# EAGLE design FTDI_PROG3_eagle7x (EAGLE 7.7.0)
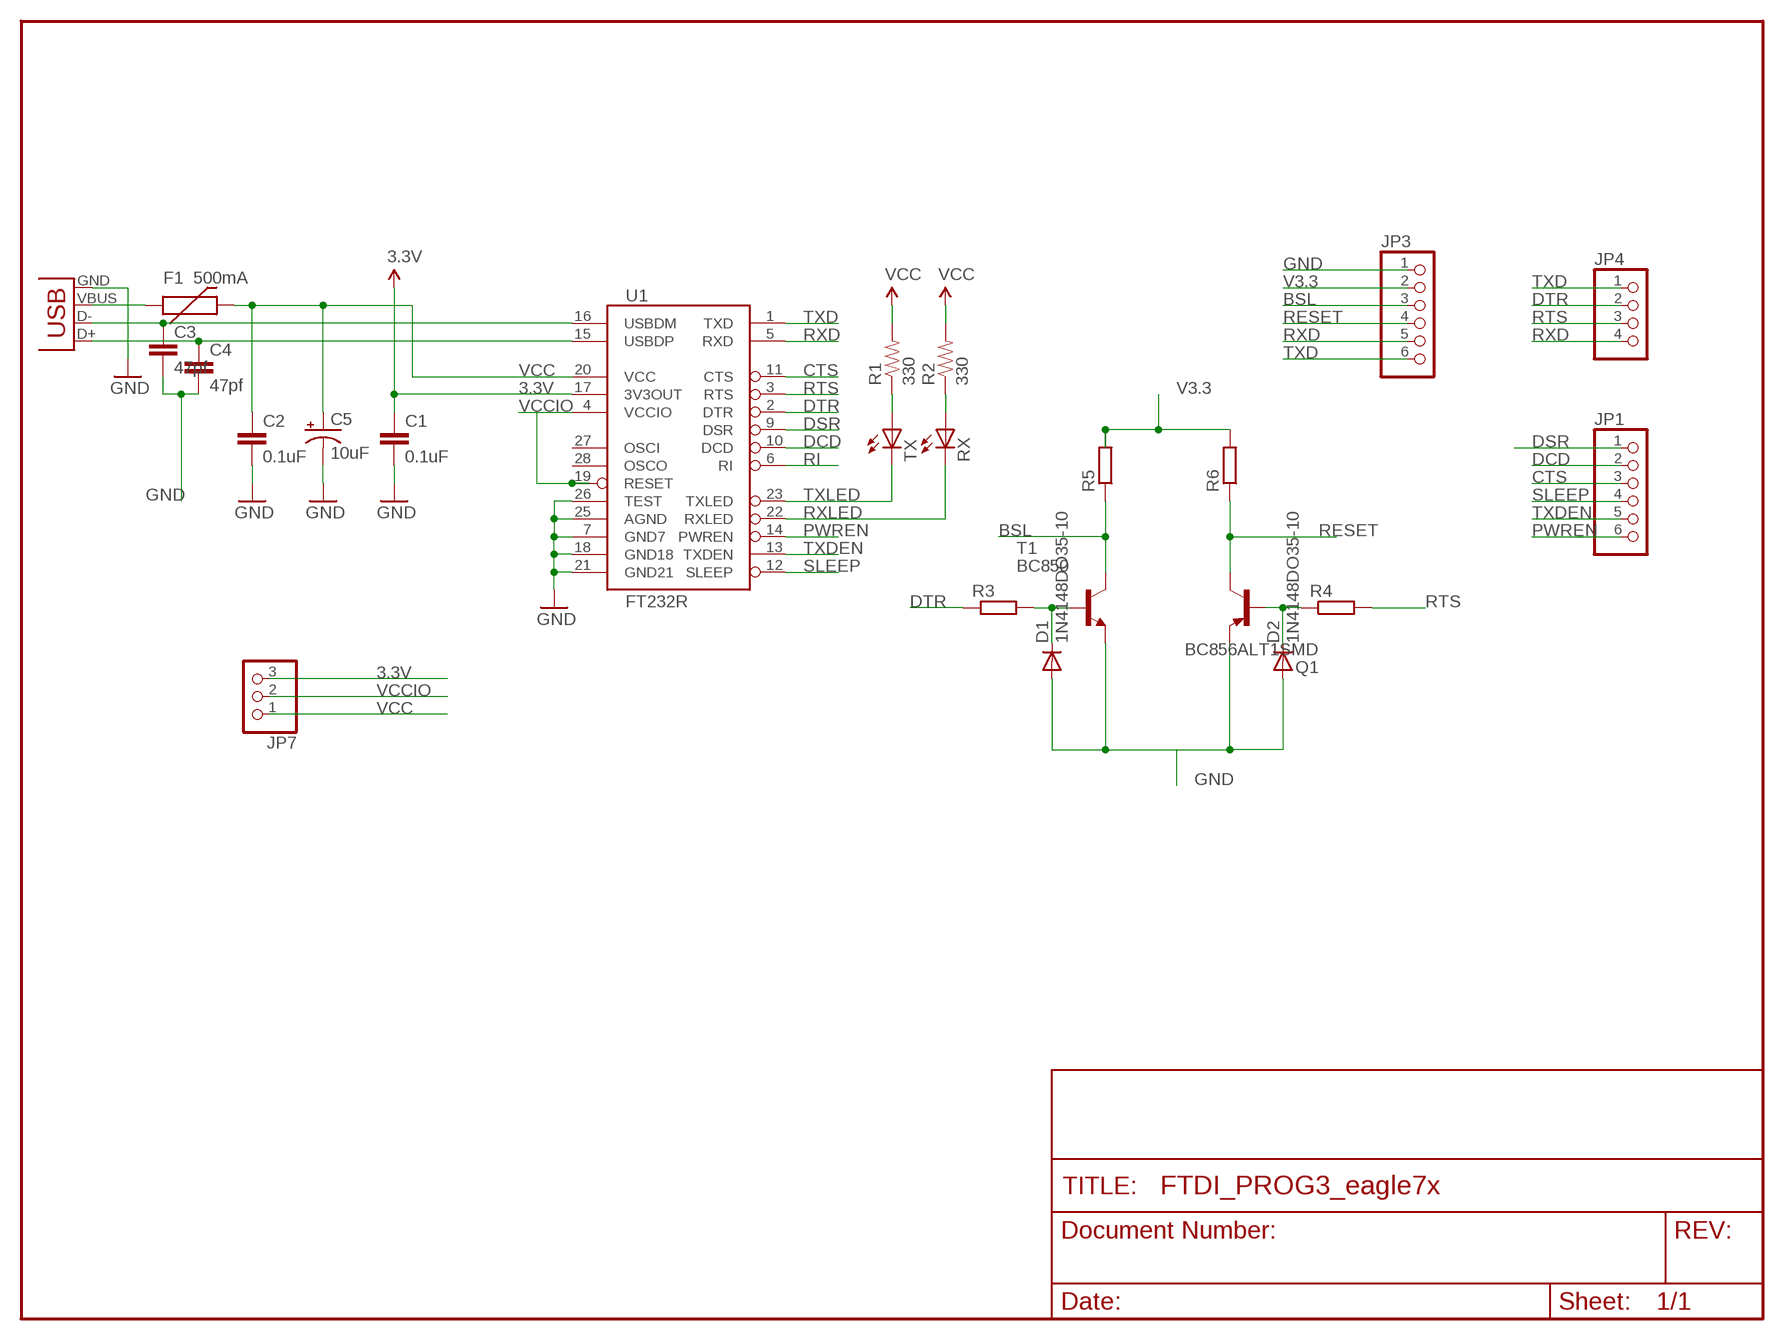
[diagram p0: schematic, sheet 1]

## Parts
C1  0.1uF  CAP1206  [1206]
C2  0.1uF  CAP1206  [1206]
C3  47pf  C-EU025-024X044  [C025-024X044]
C4  47pf  C-EU025-025X050  [C025-025X050]
C5  10uF  CAP_POLPTH1  [CPOL-RADIAL-100UF-25V]
D1  1N4148DO35-10  [DO35-10]
D2  1N4148DO35-10  [DO35-10]
F1  500mA  PTCSMD  [PTC-1206]
JP1  PINHD-1X6  [1X06]
JP3  PINHD-1X6  [1X06]
JP4  PINHD-1X4  [1X04]
JP7  PINHD-1X3  [1X03]
Q1  BC856ALT1SMD  [SOT23-BEC]
R1  330  RESISTOR1206  [1206]
R2  330  RESISTOR1206  [1206]
R3  R-EU_0207/10  [0207/10]
R4  R-EU_0207/10  [0207/10]
R5  R-EU_0207/10  [0207/10]
R6  R-EU_0207/10  [0207/10]
RX  LED1206  [LED-1206]
T1  BC850  [SOT23]
TX  LED1206  [LED-1206]
U1  FT232R  FT232RLSSOP  [SSOP28DB]
X2  USBPTH  [USB-B-PTH]

## Nets
3.3V [power]: C1.1 JP7.3 U1.17(3V3OUT)
BSL: JP3.3 R5.1 T1.3(C)
CTS: JP1.3 U1.11(CTS)
DCD: JP1.2 U1.10(DCD)
DSR: JP1.1 U1.9(DSR)
DTR: JP4.2 R3.1 U1.2(DTR)
GND [power]: C1.2 C2.2 C3.2 C4.2 C5.2(-) D1.A D2.A JP3.1 Q1.E T1.2(E) U1.7(GND7) U1.18(GND18) U1.21(GND21) U1.25(AGND) U1.26(TEST) X2.GND
N$1: R1.1 TX.A
N$2: R2.1 RX.A
N$3: F1.1 X2.VBUS
N$4: D1.C R3.2 T1.1(B)
N$5: D2.C Q1.B R4.1
PWREN: JP1.6 U1.14(PWREN)
RESET: JP3.4 Q1.C R6.1
RI: U1.6(RI)
RTS: JP4.3 R4.2 U1.3(RTS)
RXD: JP3.5 JP4.4 U1.5(RXD)
RXLED: RX.C U1.22(RXLED)
SLEEP: JP1.4 U1.12(SLEEP)
TXD: JP3.6 JP4.1 U1.1(TXD)
TXDEN: JP1.5 U1.13(TXDEN)
TXLED: TX.C U1.23(TXLED)
USB_D+: C4.1 U1.15(USBDP) X2.D+
USB_D-: C3.1 U1.16(USBDM) X2.D-
V3.3: JP3.2 R5.2 R6.2
VCC [power]: C2.1 C5.1(+) F1.2 JP7.1 R1.2 R2.2 U1.20(VCC)
VCCIO: JP7.2 U1.4(VCCIO) U1.19(RESET)
Unconnected: U1.27(OSCI) U1.28(OSCO)

## Library data of the parts
C1 C2 = SparkFun:CAP: Capacitor Standard 0603 ceramic capacitor, and 0.1" leaded capacitor.
C3 C4 = rcl:C-EU: CAPACITOR, European symbol
C5 = SparkFun:CAP_POL: Capacitor Polarized These are standard SMD and PTH capacitors. Normally 10uF, 47uF, and 100uF in electrolytic and tantalum varieties. Always verify the external diameter of the through hole cap, it varies with capacity, voltage, and manufacturer. The EIA devices should be standard.
D1 D2 = diode:1N4148: DIODE high speed (Philips)
F1 = SparkFun:PTC: Resettable Fuse PTC Resettable Fuse. Spark Fun Electronics SKU : COM-08357
JP1 JP3 = pinhead:PINHD-1X6: PIN HEADER
JP4 = pinhead:PINHD-1X4: PIN HEADER
JP7 = pinhead:PINHD-1X3: PIN HEADER
Q1 = transistor-pnp:BC856*: PNP Transistror
R1 R2 = SparkFun:RESISTOR: Resistor Basic schematic elements and footprints for 0603, 1206, and PTH 1/10th watt (small) resistors.
R3-R6 = resistor:R-EU_: RESISTOR, European symbol
RX TX = SparkFun:LED: LEDs Standard schematic elements and footprints for 5mm, 3mm, 1206, and 0603 sized LEDs. 5mm - Spark Fun Electronics SKU : COM-00529 (and others)
T1 = transistor:BC850: NPN TRANSISTOR
U1 = SparkFun:FT232RL: USB UART FT232RL 4th Generation USB UART (USB <-> Serial) Controller. Spark Fun Electronics SKU : COM-00650
X2 = SparkFun:USB: USB Connectors USB-B-PTH is fully proven SKU : PRT-00139 USB-miniB is fully proven SKU : PRT-00587 USB-A-PCB is untested. USB-A-H is throughly reviewed, but untested. Spark Fun Electronics SKU : PRT-00437 USB-B-SMT is throughly reviewed, but untested. Needs silkscreen touching up. USB-A-S has not been used/tested USB-MB-H has not been used/tested

## Net classes
0 default: width 0.203 mm
1 power: width 0.254 mm

## Board
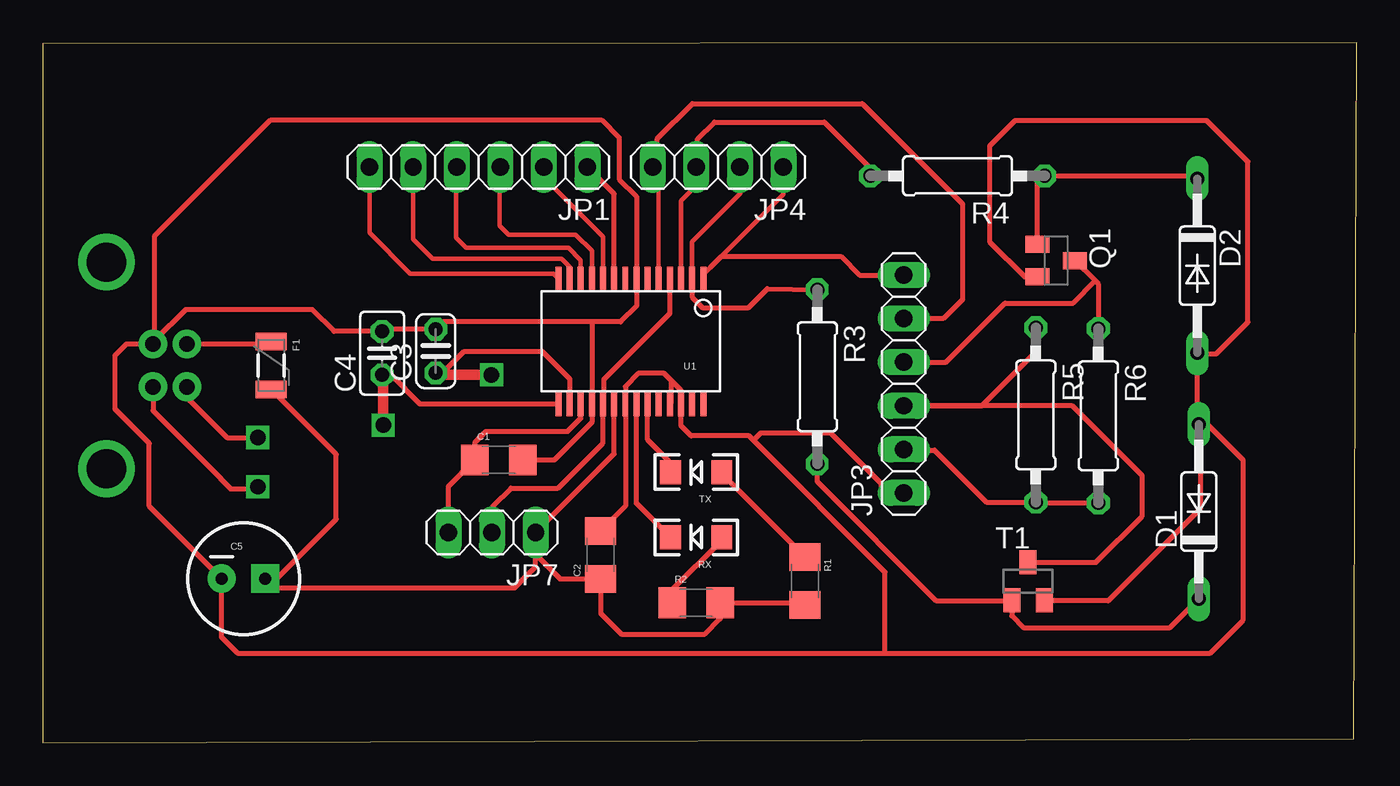
[diagram p1: board, top side]
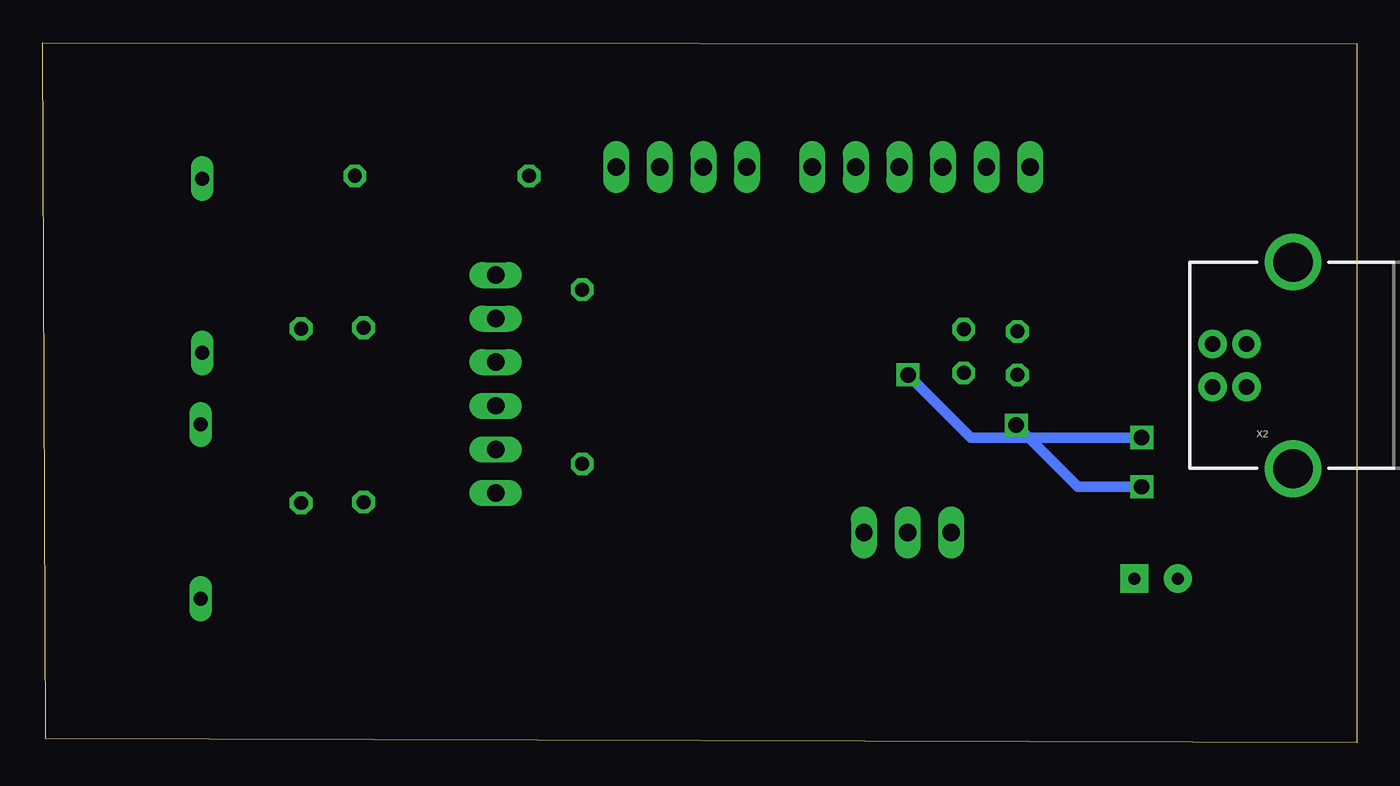
[diagram p2: board, bottom side, seen from below]

Size 76.61 x 40.81 mm. Coordinates in mm from the lower left corner, seen from the top.
Outline: 0,0 76.44,0.23 76.61,40.81 0,40.76 0,0
Copper layers (1*16): Top 0.035mm / dielectric 1.5mm / Bottom 0.035mm
Design rules "default": minimum track width 10mil, minimum drill 24mil, track to track 8mil, track to pad 8mil, pad to pad 8mil, via to via 8mil, smd to smd 8mil, copper to edge 40mil, drill to drill 8mil, minimum pad ring 10mil, minimum via ring 8mil, stop-mask expansion 4mil, vias tented up to drill 0mil, thermal gap 10mil

### Footprints (pad centres in the part's own frame; a part is rotated, then mirrored left to right if it is on the bottom)
1206 = smd 1.6 x 1.8: 1 -1.4,0; 2 1.4,0
C025-024X044 = drill 0.813 octagon: 1 -1.27,0; 2 1.27,0
C025-025X050 = drill 0.813 octagon: 1 -1.27,0; 2 1.27,0
CPOL-RADIAL-100UF-25V = drill 0.7 pad 1.651 square: 1 1.27,0 | drill 0.7 pad 1.651: 2 -1.27,0
DO35-10 = drill 0.813 long: A 5.08,0; C -5.08,0
PTC-1206 = smd 1 x 1.8: 1 -1.4,0; 2 1.4,0
1X06 = drill 1.016 long: 1 -6.35,0; 2 -3.81,0; 3 -1.27,0; 4 1.27,0; 5 3.81,0; 6 6.35,0
1X04 = drill 1.016 long: 1 -3.81,0; 2 -1.27,0; 3 1.27,0; 4 3.81,0
1X03 = drill 1.016 long: 1 -2.54,0; 2 0,0; 3 2.54,0
SOT23-BEC = smd 1 x 1.4: B -0.95,-1.1; C 0,1.1; E 0.95,-1.1
0207/10 = drill 0.813 octagon: 1 -5.08,0; 2 5.08,0
LED-1206 = smd 1.2 x 1.4: A -1.5,0; C 1.5,0
SOT23 = smd 1 x 1.4: 1 -0.95,-1.1; 2 0.95,-1.1; 3 0,1.1
SSOP28DB = smd 0.348 x 1.397: 1 -4.225,-3.656; 2 -3.575,-3.656; 3 -2.925,-3.656; 4 -2.275,-3.656; 5 -1.625,-3.656; 6 -0.975,-3.656; 7 -0.325,-3.656; 8 0.325,-3.656; 9 0.975,-3.656; 10 1.625,-3.656; 11 2.275,-3.656; 12 2.925,-3.656; 13 3.575,-3.656; 14 4.225,-3.656; 15 4.225,3.656; 16 3.575,3.656; 17 2.925,3.656; 18 2.275,3.656; 19 1.625,3.656; 20 0.975,3.656; 21 0.325,3.656; 22 -0.325,3.656; 23 -0.975,3.656; 24 -1.625,3.656; 25 -2.275,3.656; 26 -2.925,3.656; 27 -3.575,3.656; 28 -4.225,3.656
USB-B-PTH = drill 0.914 pad 1.676: D+ 0,1.25; D- 1.981,1.25; GND 0,-1.25; VBUS 1.981,-1.25 | drill 2.286: P$1 -2.718,-6.02; P$2 -2.718,6.02

### Placement (x,y rotation side)
C1  26.59,16.49 0 top
C2  32.52,10.96 90 top
C3  22.91,22.84 90 top
C4  19.79,22.72 90 top
C5  11.7,9.58 0 top
D1  67.41,13.48 90 top
D2  67.32,27.82 270 top
F1  13.32,22 270 top
JP1  25.4,33.57 180 top
JP3  50.21,20.92 90 top
JP4  39.37,33.57 180 top
JP7  26.19,12.27 180 top
Q1  59.09,28.11 270 top
R1  44.45,9.44 270 top
R2  38.1,8.17 0 top
R3  45.16,21.34 270 top
R4  53.34,33.05 180 top
R5  57.91,19.12 270 top
R6  61.55,19.06 270 top
RX  38.1,11.98 180 top
T1  57.45,9.42 0 top
TX  38.1,15.79 180 top
U1  34.29,23.41 180 top
X2  6.42,22 180 bottom

### Tracks (layer width: path | path; a pad name or v marks a point on that pad's centre or on a via)
3.3V
  Top 0.305: JP7.3 23.65,14.95 C1.1 25.2,16.5 25.2,17.52 25.84,18.16 30.6,18.16 31.36,18.92 U1.17
BSL
  Top 0.305: R5.1 57.99,24.11 57.99,22.89 54.75,19.65 JP3.3 60.03,19.65 64.11,15.57 64.11,13.22 61.41,10.52 T1.3
CTS
  Top 0.254: U1.11 32.02,28.68 31.07,29.63 27.15,29.63 26.64,30.14 26.64,33.54 JP1.3
DCD
  Top 0.254: U1.10 32.66,29.5 29.22,32.94 29.22,33.56 JP1.2
DSR
  Top 0.305: JP1.1 33.31,32 U1.9
DTR
  Top 0.254: U1.2 37.87,29.21 40.68,32.03 40.68,33.53 JP4.2
  Top 0.305: R3.1 42.25,26.47 41.16,25.38 38.47,25.38 37.86,25.99 37.86,27.06 U1.2
GND
  Top 0.305: Q1.E 57.26,27.16 55.2,29.22 55.2,34.78 56.7,36.28 67.87,36.28 70.27,33.88 70.27,24.52 68.42,22.68 67.38,22.68 D2.A 67.32,18.65 D1.A | T1.2 58.44,8.28 62.13,8.28 67.49,13.64 67.49,18.48 D1.A | 36.62,21.14 36.22,21.53 34.72,21.53 33.97,20.78 U1.21 33.97,13.8 C2.2 | 36.62,21.14 36.62,19.81 U1.25 | 36.62,21.14 37.22,20.54 U1.26 37.22,18.48 37.8,17.89 41.18,17.89 41.44,17.64 | C1.2 29.82,16.49 32.02,18.68 U1.18 32.02,19.76 32.02,24.54 | JP3.1 50.12,14.48 48.88,14.48 48.88,15.13 45.93,18.07 41.87,18.07 41.44,17.64 | D1.A 67.92,18.56 70,16.48 70,7.16 68.08,5.23 49.12,5.23 | 49.12,5.23 11.35,5.23 10.43,6.16 C5.2 6.21,13.79 6.21,17.45 4.21,19.45 4.21,22.59 4.88,23.25 X2.GND 6.53,23.36 6.53,29.57 13.29,36.32 32.58,36.32 33.61,35.29 33.61,32.87 34.62,31.86 U1.7 34.62,25.45 33.7,24.54 32.02,24.54 | 32.02,24.54 23.34,24.54 C3.2 19.91,24.11 C4.2 16.97,23.99 15.71,25.26 8.32,25.26 6.52,23.46 6.52,23.22 | 41.44,17.64 49.12,9.96 49.12,5.23
N$1
  Top 0.305: TX.A 39.6,15.69 R1.1
N$2
  Top 0.305: RX.A 39.6,11.82 36.64,8.86 36.64,8.23 R2.1
N$3
  Top 0.305: X2.VBUS 13.17,23.25 F1.1
N$4
  Top 0.305: D1.C 65.73,6.72 57.18,6.72 56.5,7.4 T1.1 56.48,8.3 52.09,8.3 45.16,15.22 R3.2
N$5
  Top 0.305: D2.C 67.16,33.06 R4.1 57.99,32.63 Q1.B
PWREN
  Top 0.254: JP1.6 19.05,29.73 21.43,27.35 29.78,27.35 U1.14
RESET
  Top 0.305: 61.38,26.93 Q1.C | 61.38,26.93 61.55,26.76 R6.1 | JP3.4 52.67,22.19 56.11,25.63 60.09,25.63 61.38,26.93
RTS
  Top 0.254: U1.3 37.22,31.59 38.12,32.5 | 38.12,33.54 JP4.3
  Top 0.305: 38.12,32.5 38.12,33.54 | R4.2 48.26,33.51 45.58,36.19 39.17,36.19 38.19,35.21 38.19,33.65 JP4.3
RXD
  Top 0.254: U1.5 35.91,33.21 JP4.4
  Top 0.305: JP3.5 52.52,24.73 53.63,25.84 53.63,31.43 47.78,37.27 37.88,37.27 35.83,35.22 35.83,33.83 JP4.4
RXLED
  Top 0.305: U1.22 34.62,13.96 RX.C
SLEEP
  Top 0.254: U1.12 31.36,28.15 30.65,28.86 24.67,28.86 24.09,29.45 24.09,33.53 JP1.4
TXD
  Top 0.254: U1.1 38.52,27.32 38.92,27.72 43.18,31.98 JP4.1
  Top 0.305: JP3.6 47.62,27.27 46.53,28.37 39.56,28.37 38.92,27.72
TXDEN
  Top 0.254: U1.13 30.71,27.76 30.26,28.22 22.74,28.22 21.6,29.36 JP1.5
TXLED
  Top 0.305: U1.23 35.27,17.67 36.5,16.44 36.5,15.89 TX.C
USB_D+  (via drill 0.9)
  Top 0.305: C4.1 20.3,21.45 21.98,19.77 30.05,19.77 U1.15 | X2.D+ 6.42,19.37 10.39,15.4 10.39,15.36 10.95,14.8 12.4,14.8 v12.53,14.93
  Top 0.61: v19.84,18.52 19.84,21.39 C4.1
  Bottom 0.61: v12.53,14.93 16.25,14.93 v19.84,18.52
USB_D-  (via drill 0.9)
  Top 0.305: X2.D- 8.4,20.13 10.73,17.8 v12.53,17.8 | C3.1 23.32,21.57 24.57,22.82 29.12,22.82 30.72,21.23 U1.16
  Top 0.61: v26.16,21.46 23.02,21.46 C3.1
  Bottom 0.61: v12.53,17.8 22.5,17.8 v26.16,21.46
V3.3
  Top 0.305: R6.2 57.96,13.98 R5.2 55.04,14.04 52,17.07 50.25,17.07 JP3.2
VCC
  Top 0.305: R1.2 44.32,8.17 R2.2 39.49,7.23 38.6,6.34 33.73,6.34 32.52,7.54 C2.1 30.16,9.56 28.73,10.98 | U1.20 33.31,16.85 JP7.1 28.73,10.98 | 28.73,10.98 28.73,10.25 27.51,9.03 13.51,9.03 C5.1 13.64,9.58 17.11,13.05 17.11,16.82 F1.2 12.97,20.25
VCCIO
  Top 0.305: U1.4 36.56,25.04 32.72,21.19 32.72,19.8 U1.19 32.66,17.48 30.04,14.85 27.29,14.85 26.25,13.81 26.25,12.33 JP7.2